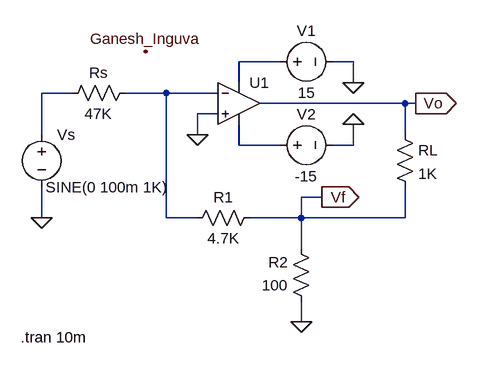
[diagram p0: schematic Run 4_B.asc]
Run 4_B.asc, the LTspice schematic file:
Version 4
SHEET 1 880 680
WIRE 304 -16 240 -16
WIRE 416 -16 384 -16
WIRE 240 16 240 -16
WIRE 416 16 416 -16
WIRE -16 32 -64 32
WIRE 128 32 64 32
WIRE 208 32 128 32
WIRE 496 48 272 48
WIRE 512 48 496 48
WIRE 208 64 176 64
WIRE -64 96 -64 32
WIRE 176 96 176 64
WIRE 496 96 496 48
WIRE 240 112 240 80
WIRE 304 112 240 112
WIRE 416 112 416 80
WIRE 416 112 384 112
WIRE 368 192 336 192
WIRE -64 224 -64 176
WIRE 128 224 128 32
WIRE 176 224 128 224
WIRE 336 224 336 192
WIRE 336 224 256 224
WIRE 496 224 496 176
WIRE 496 224 336 224
WIRE 336 272 336 224
WIRE 336 384 336 352
FLAG 416 16 0
FLAG 416 80 0
FLAG 176 96 0
FLAG 512 48 Vo
IOPIN 512 48 Out
FLAG 336 384 0
FLAG -64 224 0
FLAG 96 -32 Ganesh_Inguva
FLAG 368 192 Vf
IOPIN 368 192 Out
SYMBOL OpAmps\\UniversalOpamp2 240 48 R0
SYMATTR InstName U1
SYMBOL voltage 288 -16 R270
WINDOW 0 32 56 VTop 2
WINDOW 3 -32 56 VBottom 2
WINDOW 123 0 0 Left 0
WINDOW 39 0 0 Left 0
SYMATTR InstName V1
SYMATTR Value 15
SYMBOL voltage 288 112 R270
WINDOW 0 32 56 VTop 2
WINDOW 3 -32 56 VBottom 2
WINDOW 123 0 0 Left 0
WINDOW 39 0 0 Left 0
SYMATTR InstName V2
SYMATTR Value -15
SYMBOL res 272 208 R90
WINDOW 0 0 56 VBottom 2
WINDOW 3 32 56 VTop 2
SYMATTR InstName R1
SYMATTR Value 4.7K
SYMBOL res 352 368 R180
WINDOW 0 36 76 Left 2
WINDOW 3 36 40 Left 2
SYMATTR InstName R2
SYMATTR Value 100
SYMBOL res 480 80 R0
SYMATTR InstName RL
SYMATTR Value 1K
SYMBOL voltage -64 80 R0
WINDOW 3 6 97 Left 2
WINDOW 123 0 0 Left 0
WINDOW 39 0 0 Left 0
SYMATTR Value SINE(0 100m 1K)
SYMATTR InstName Vs
SYMBOL res 80 16 R90
WINDOW 0 0 56 VBottom 2
WINDOW 3 32 56 VTop 2
SYMATTR InstName Rs
SYMATTR Value 47K
TEXT -96 408 Left 2 !.tran 10m

The netlist it stands for:
* Run 4_B.asc
XU1 0 N003 N001 N004 Vo level.2 Avol=1Meg GBW=10Meg Slew=10Meg ilimit=25m rail=0 Vos=0 phimargin=45 en=0 enk=0 in=0 ink=0 Rin=500Meg  ; pins IN+ IN- V+ V- OUT
V1 N001 0 15
V2 N004 0 -15
R1 Vf N003 4.7K
R2 0 Vf 100
RL Vo Vf 1K
Vs N002 0 SINE(0 100m 1K)
Rs N003 N002 47K
.tran 10m
.lib UniversalOpamps2.sub
.backanno
.end